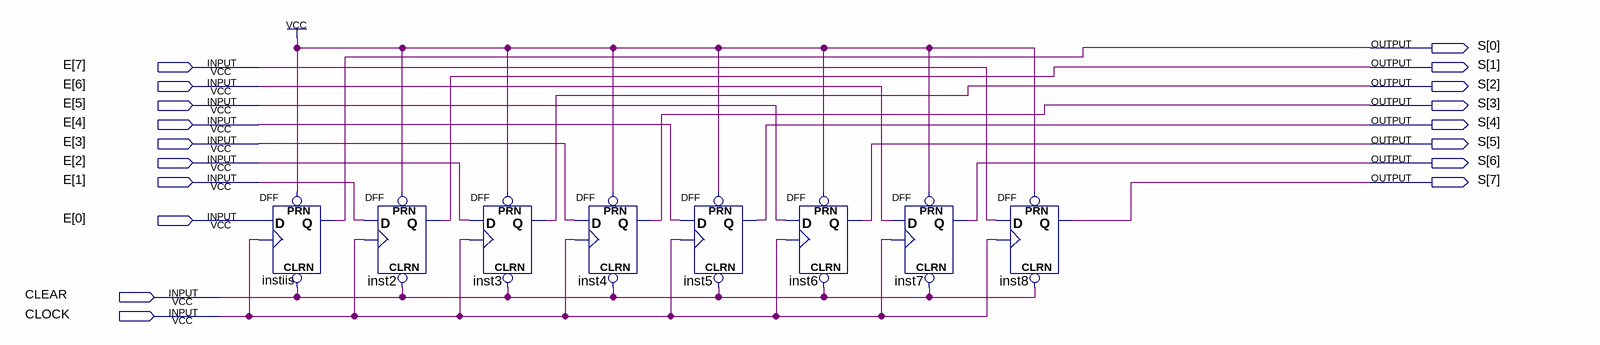
[diagram p0: schematic sheet]
// Quartus schematic row.bdf as structural Verilog: 8 symbols, 18 pins
module row (
  input  [7:0] E,
  input  CLEAR,
  input  CLOCK,
  output [7:0] S
);

  DFF instiis (.CLRN(CLEAR), .CLK(CLOCK), .D(E[0]), .PRN(1'b1), .Q(S[0]));
  DFF inst2 (.CLRN(CLEAR), .CLK(CLOCK), .D(E[1]), .PRN(1'b1), .Q(S[1]));
  DFF inst3 (.CLRN(CLEAR), .CLK(CLOCK), .D(E[2]), .PRN(1'b1), .Q(S[2]));
  DFF inst4 (.CLRN(CLEAR), .CLK(CLOCK), .D(E[3]), .PRN(1'b1), .Q(S[3]));
  DFF inst5 (.CLRN(CLEAR), .CLK(CLOCK), .D(E[4]), .PRN(1'b1), .Q(S[4]));
  DFF inst6 (.CLRN(CLEAR), .CLK(CLOCK), .D(E[5]), .PRN(1'b1), .Q(S[5]));
  DFF inst7 (.CLRN(CLEAR), .CLK(CLOCK), .D(E[6]), .PRN(1'b1), .Q(S[6]));
  DFF inst8 (.CLRN(CLEAR), .CLK(CLOCK), .D(E[7]), .PRN(1'b1), .Q(S[7]));
endmodule
